# Altium schematic sheet CET-124-120W_main.SchDoc
size A4
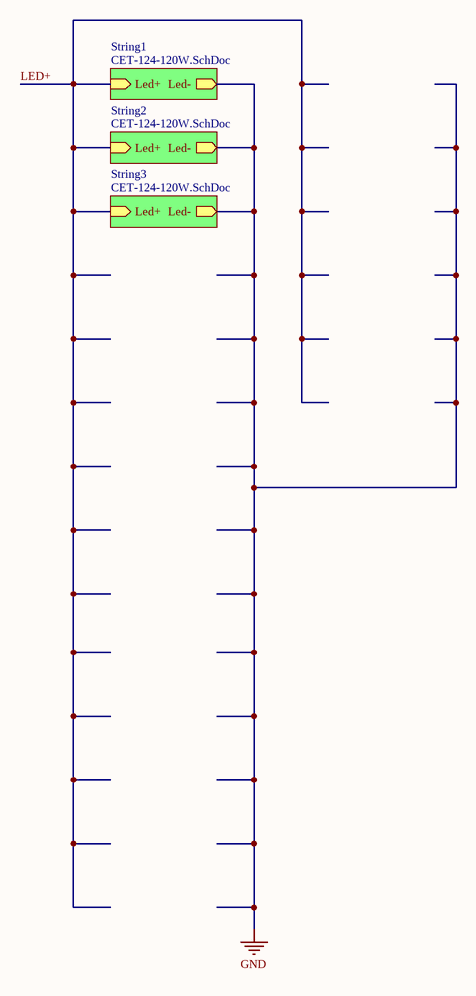
[diagram p0: CET-124-120W_main.SchDoc]

## Sub-sheets
String1 = CET-124-120W.SchDoc: Led- (out), Led+ (in)
String2 = CET-124-120W.SchDoc: Led- (out), Led+ (in)
String3 = CET-124-120W.SchDoc: Led- (out), Led+ (in)

## Nets
GND: sheet String1/Led-, sheet String2/Led-, sheet String3/Led-
LED+: sheet String1/Led+, sheet String2/Led+, sheet String3/Led+